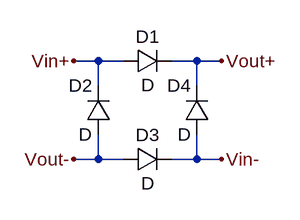
[diagram p0: schematic Puente de diodos.asc]
Puente de diodos.asc, the LTspice schematic file:
Version 4
SHEET 1 880 680
WIRE 112 64 80 64
WIRE 144 64 112 64
WIRE 240 64 208 64
WIRE 272 64 240 64
WIRE 112 96 112 64
WIRE 240 96 240 64
WIRE 112 192 112 160
WIRE 112 192 80 192
WIRE 144 192 112 192
WIRE 240 192 240 160
WIRE 240 192 208 192
WIRE 272 192 240 192
FLAG 80 64 Vin+
FLAG 272 192 Vin-
FLAG 272 64 Vout+
FLAG 80 192 Vout-
SYMBOL diode 144 80 R270
WINDOW 0 32 32 VTop 2
WINDOW 3 0 32 VBottom 2
SYMATTR InstName D1
SYMBOL diode 128 160 R180
WINDOW 0 24 64 Left 2
WINDOW 3 24 0 Left 2
SYMATTR InstName D2
SYMBOL diode 144 208 R270
WINDOW 0 32 32 VTop 2
WINDOW 3 0 32 VBottom 2
SYMATTR InstName D3
SYMBOL diode 256 160 R180
WINDOW 0 24 64 Left 2
WINDOW 3 24 0 Left 2
SYMATTR InstName D4

The netlist it stands for:
* Puente de diodos.asc
D1 Vin+ Vout+ D
D2 Vout- Vin+ D
D3 Vout- Vin- D
D4 Vin- Vout+ D
.model D D
.lib standard.dio
.backanno
.end